# Altium schematic sheet F200s.SchDoc: RF
size A4; Date: 20150330; DrawnBy: mango; DocumentNumber: 1; SheetNumber: 1; SheetTotal: 7; CurrentTime: sdfsdfsd
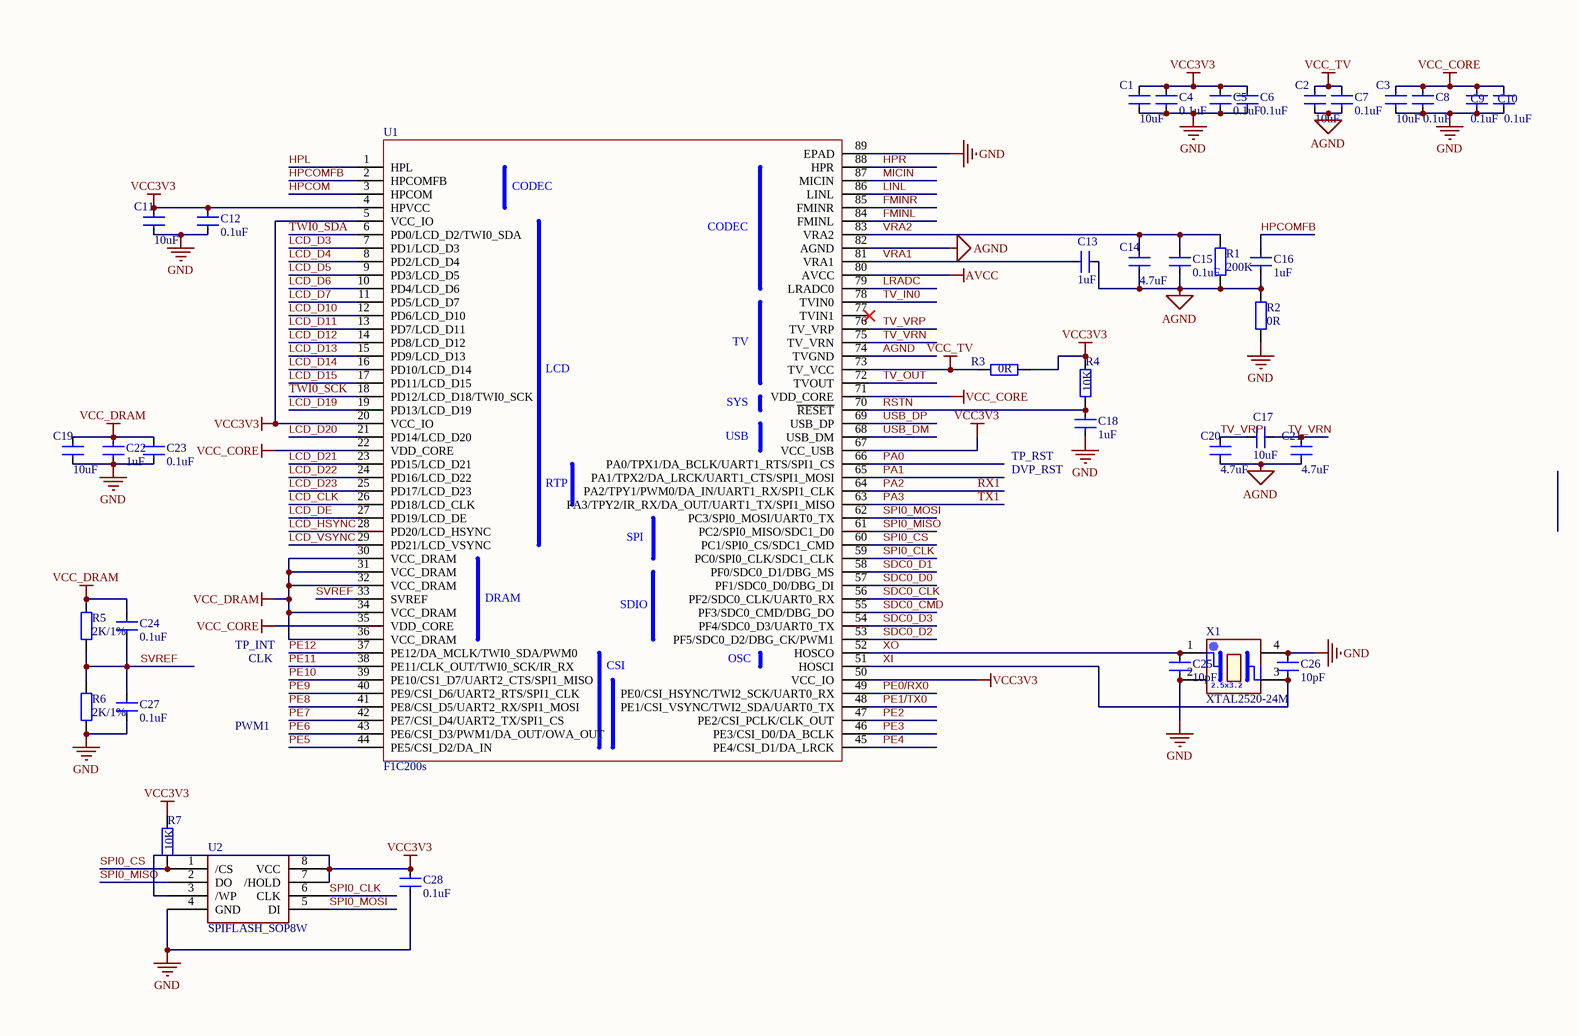
[diagram p0: F200s.SchDoc]

## Parts
C1  10uF  [C0402]
C2  10uF  [C0402]
C3  10uF  [C0402]
C4  0.1uF  [C0402]
C5  0.1uF  [C0402]
C6  0.1uF  [C0402]
C7  0.1uF  [C0402]
C8  0.1uF  [C0402]
C9  0.1uF  [C0402]
C10  0.1uF  [C0402]
C11  10uF  [C0402]
C12  0.1uF  [C0402]
C13  1uF  [C0402]
C14  4.7uF  [C0402]
C15  0.1uF  [C0402]
C16  1uF  [C0402]
C17  10uF  [C0402]
C18  1uF  [C0402]
C19  10uF  [C0402]
C20  4.7uF  [C0402]
C21  4.7uF  [C0402]
C22  1uF  [C0402]
C23  0.1uF  [C0402]
C24  0.1uF  [C0402]
C25  10pF  [C0402]
C26  10pF  [C0402]
C27  0.1uF  [C0402]
C28  0.1uF  [C0402]
R1  200K  [R0402]
R2  0R  [R0402]
R3  0R  [R0402]
R4  10K  [R0402]
R5  2K/1%  [R0402]
R6  2K/1%  [R0402]
R7  10K  [R0402]
U1  F1C200s  [QFN40P1000X1000X85_HS-89N]
U2  SPIFLASH_SOP8W  [WSON-SPIFLASH]
X1  XTAL2520-24M  [XTAL2520]

## Nets
AGND: C2.1 C7.1 C13.2 C14.1 C15.1 C16.2 C20.1 C21.1 R1.1 R2.2 U1.74(TVGND) U1.82(AGND)
AVCC: U1.80(AVCC)
GND: C1.1 C3.1 C4.1 C5.1 C6.1 C8.1 C9.1 C10.1 C11.1 C12.2 C18.2 C19.1 C22.1 C23.1 C25.1 C26.2 C27.1 C28.1 R2.1 R6.1 U1.89(EPAD) U2.4(GND) X1.2(NC1) X1.4(NC2)
VCC3V3: C1.2 C4.2 C5.2 C6.2 C11.2 C12.1 C28.2 R3.1 R4.2 R7.2 U1.4(HPVCC) U1.5(VCC_IO) U1.20(VCC_IO) U1.50(VCC_IO) U1.67(VCC_USB) U2.3(/WP) U2.7(/HOLD) U2.8(VCC)
VCC_CORE: C3.2 C8.2 C9.2 C10.2 U1.22(VDD_CORE) U1.35(VDD_CORE) U1.71(VDD_CORE)
VCC_DRAM: C19.2 C22.2 C23.2 C24.2 R5.2 U1.30(VCC_DRAM) U1.31(VCC_DRAM) U1.32(VCC_DRAM) U1.34(VCC_DRAM) U1.36(VCC_DRAM)
VCC_TV: C2.2 C7.2 R3.2 U1.73(TV_VCC)
FMINL: U1.84(FMINL)
FMINR: U1.85(FMINR)
HPCOM: U1.3(HPCOM)
HPCOMFB: C16.1 U1.2(HPCOMFB)
HPL: U1.1(HPL)
HPR: U1.88(HPR)
LCD_CLK: U1.26(PD18/LCD_CLK)
LCD_D3: U1.7(PD1/LCD_D3)
LCD_D4: U1.8(PD2/LCD_D4)
LCD_D5: U1.9(PD3/LCD_D5)
LCD_D6: U1.10(PD4/LCD_D6)
LCD_D7: U1.11(PD5/LCD_D7)
LCD_D10: U1.12(PD6/LCD_D10)
LCD_D11: U1.13(PD7/LCD_D11)
LCD_D12: U1.14(PD8/LCD_D12)
LCD_D13: U1.15(PD9/LCD_D13)
LCD_D14: U1.16(PD10/LCD_D14)
LCD_D15: U1.17(PD11/LCD_D15)
LCD_D19: U1.19(PD13/LCD_D19)
LCD_D20: U1.21(PD14/LCD_D20)
LCD_D21: U1.23(PD15/LCD_D21)
LCD_D22: U1.24(PD16/LCD_D22)
LCD_D23: U1.25(PD17/LCD_D23)
LCD_DE: U1.27(PD19/LCD_DE)
LCD_HSYNC: U1.28(PD20/LCD_HSYNC)
LCD_VSYNC: U1.29(PD21/LCD_VSYNC)
LINL: U1.86(LINL)
LRADC: U1.79(LRADC0)
MICIN: U1.87(MICIN)
PA0: U1.66(PA0/TPX1/DA_BCLK/UART1_RTS/SPI1_CS)
PA1: U1.65(PA1/TPX2/DA_LRCK/UART1_CTS/SPI1_MOSI)
PA2: U1.64(PA2/TPY1/PWM0/DA_IN/UART1_RX/SPI1_CLK)  [also labelled RX1]
PA3: U1.63(PA3/TPY2/IR_RX/DA_OUT/UART1_TX/SPI1_MISO)  [also labelled TX1]
PE0/RX0: U1.49(PE0/CSI_HSYNC/TWI2_SCK/UART0_RX)
PE1/TX0: U1.48(PE1/CSI_VSYNC/TWI2_SDA/UART0_TX)
PE2: U1.47(PE2/CSI_PCLK/CLK_OUT)
PE3: U1.46(PE3/CSI_D0/DA_BCLK)
PE4: U1.45(PE4/CSI_D1/DA_LRCK)
PE5: U1.44(PE5/CSI_D2/DA_IN)
PE6: U1.43(PE6/CSI_D3/PWM1/DA_OUT/OWA_OUT)
PE7: U1.42(PE7/CSI_D4/UART2_TX/SPI1_CS)
PE8: U1.41(PE8/CSI_D5/UART2_RX/SPI1_MOSI)
PE9: U1.40(PE9/CSI_D6/UART2_RTS/SPI1_CLK)
PE10: U1.39(PE10/CS1_D7/UART2_CTS/SPI1_MISO)
PE11: U1.38(PE11/CLK_OUT/TWI0_SCK/IR_RX)
PE12: U1.37(PE12/DA_MCLK/TWI0_SDA/PWM0)
RSTN: C18.1 R4.1 U1.70(~{RESET})
SDC0_CLK: U1.56(PF2/SDC0_CLK/UART0_RX)
SDC0_CMD: U1.55(PF3/SDC0_CMD/DBG_DO)
SDC0_D0: U1.57(PF1/SDC0_D0/DBG_DI)
SDC0_D1: U1.58(PF0/SDC0_D1/DBG_MS)
SDC0_D2: U1.53(PF5/SDC0_D2/DBG_CK/PWM1)
SDC0_D3: U1.54(PF4/SDC0_D3/UART0_TX)
SPI0_CLK: U1.59(PC0/SPI0_CLK/SDC1_CLK) U2.6(CLK)
SPI0_CS: R7.1 U1.60(PC1/SPI0_CS/SDC1_CMD) U2.1(/CS)
SPI0_MISO: U1.61(PC2/SPI0_MISO/SDC1_D0) U2.2(DO)
SPI0_MOSI: U1.62(PC3/SPI0_MOSI/UART0_TX) U2.5(DI)
SVREF: C24.1 C27.2 R5.1 R6.2 U1.33(SVREF)
TV_IN0: U1.78(TVIN0)
TV_OUT: U1.72(TVOUT)
TV_VRN: C17.1 C21.2 U1.75(TV_VRN)
TV_VRP: C17.2 C20.2 U1.76(TV_VRP)
TWI0_SCK: U1.18(PD12/LCD_D18/TWI0_SCK)
TWI0_SDA: U1.6(PD0/LCD_D2/TWI0_SDA)
USB_DM: U1.68(USB_DM)
USB_DP: U1.69(USB_DP)
VRA1: C13.1 U1.81(VRA1)
VRA2: C14.2 C15.2 R1.2 U1.83(VRA2)
XI: C26.1 U1.51(HOSCI) X1.3(X2)
XO: C25.2 U1.52(HOSCO) X1.1(X1)

Not connected (* = marked no-connect by the designer): U1 77(TVIN1)*

## Notes on the sheet
- (near C18) DVP_RST
- TP_RST
- TP_INT
- CLK
- PWM1
- (in symbol F1C200s) CODEC; TV; LCD; SYS; USB; RTP; SPI; DRAM; SDIO; OSC; CSI
- (in symbol XTAL3225) 2.5x3.2

## Library data of the parts
C1-C28 = CAP: 普通小电容
R1-R7 = RES: 普通电阻
X1 = XTAL3225